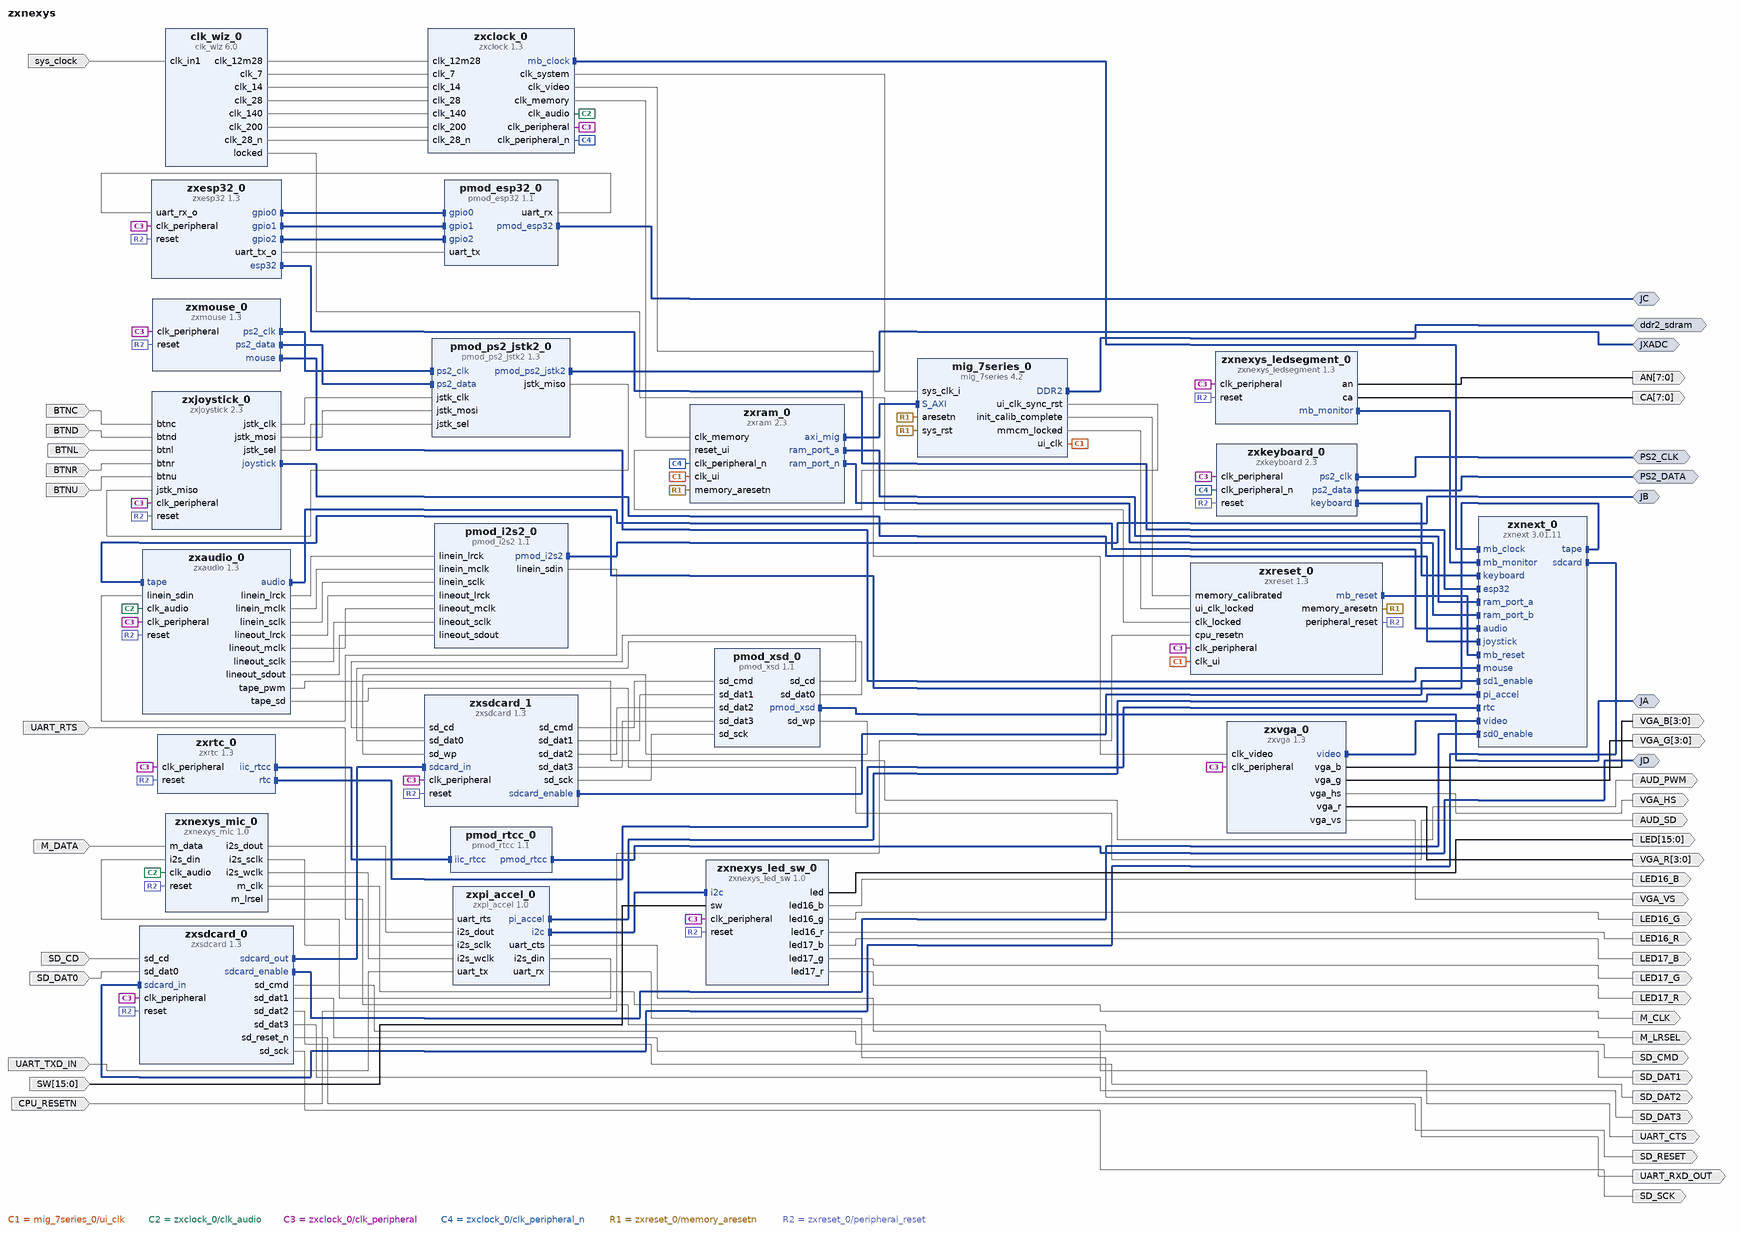
[diagram p0: block diagram of the top level]
# Vivado block design zxnexys, xc7a100tcsg324-1, Vivado 2021.2
create_bd_design zxnexys

create_bd_intf_port -mode Master -vlnv digilentinc.com:interface:pmod_rtl:1.0 JB
create_bd_intf_port -mode Master -vlnv digilentinc.com:interface:pmod_rtl:1.0 JC
create_bd_intf_port -mode Master -vlnv digilentinc.com:interface:pmod_rtl:1.0 JXADC
create_bd_intf_port -mode Master -vlnv xilinx.com:interface:gpio_rtl:1.0 PS2_CLK
create_bd_intf_port -mode Master -vlnv xilinx.com:interface:gpio_rtl:1.0 PS2_DATA
create_bd_intf_port -mode Master -vlnv digilentinc.com:interface:pmod_rtl:1.0 JD
create_bd_intf_port -mode Master -vlnv digilentinc.com:interface:pmod_rtl:1.0 JA
create_bd_intf_port -mode Master -vlnv xilinx.com:interface:ddrx_rtl:1.0 ddr2_sdram
create_bd_port -dir I -type clk sys_clock
set_property -dict {CONFIG.FREQ_HZ 100000000 CONFIG.PHASE 0.0} [get_bd_ports sys_clock]
create_bd_port -dir I -type rst CPU_RESETN
create_bd_port -dir O AUD_PWM
create_bd_port -dir O AUD_SD
create_bd_port -dir I BTNC
create_bd_port -dir I BTND
create_bd_port -dir I BTNL
create_bd_port -dir I BTNR
create_bd_port -dir I BTNU
create_bd_port -dir O -from 7 -to 0 AN
create_bd_port -dir O -from 7 -to 0 CA
create_bd_port -dir I UART_TXD_IN
create_bd_port -dir O UART_RXD_OUT
create_bd_port -dir O UART_CTS
create_bd_port -dir I UART_RTS
create_bd_port -dir I M_DATA
create_bd_port -dir O -type clk M_CLK
create_bd_port -dir O M_LRSEL
create_bd_port -dir I -from 15 -to 0 SW
create_bd_port -dir O -from 15 -to 0 LED
create_bd_port -dir O LED16_G
create_bd_port -dir O LED16_B
create_bd_port -dir O LED16_R
create_bd_port -dir O LED17_B
create_bd_port -dir O LED17_G
create_bd_port -dir O LED17_R
create_bd_port -dir I SD_CD
create_bd_port -dir I SD_DAT0
create_bd_port -dir O SD_RESET
create_bd_port -dir O SD_SCK
create_bd_port -dir O SD_CMD
create_bd_port -dir O SD_DAT1
create_bd_port -dir O SD_DAT2
create_bd_port -dir O SD_DAT3
create_bd_port -dir O -from 3 -to 0 VGA_B
create_bd_port -dir O -from 3 -to 0 VGA_G
create_bd_port -dir O VGA_HS
create_bd_port -dir O -from 3 -to 0 VGA_R
create_bd_port -dir O VGA_VS

create_bd_cell -type ip -vlnv xilinx.com:ip:clk_wiz:6.0 clk_wiz_0
set_property -dict [list \
  CONFIG.CLKOUT1_JITTER 130.488 \
  CONFIG.CLKOUT1_PHASE_ERROR 122.577 \
  CONFIG.CLKOUT1_REQUESTED_OUT_FREQ 200.000 \
  CONFIG.CLKOUT2_DRIVES No_buffer \
  CONFIG.CLKOUT2_JITTER 139.537 \
  CONFIG.CLKOUT2_PHASE_ERROR 122.577 \
  CONFIG.CLKOUT2_REQUESTED_OUT_FREQ 140.000 \
  CONFIG.CLKOUT2_USED true \
  CONFIG.CLKOUT3_DRIVES No_buffer \
  CONFIG.CLKOUT3_JITTER 193.383 \
  CONFIG.CLKOUT3_PHASE_ERROR 122.577 \
  CONFIG.CLKOUT3_REQUESTED_DUTY_CYCLE 50.000 \
  CONFIG.CLKOUT3_REQUESTED_OUT_FREQ 28.000 \
  CONFIG.CLKOUT3_REQUESTED_PHASE 180.000 \
  CONFIG.CLKOUT3_USED true \
  CONFIG.CLKOUT4_DRIVES No_buffer \
  CONFIG.CLKOUT4_JITTER 193.383 \
  CONFIG.CLKOUT4_PHASE_ERROR 122.577 \
  CONFIG.CLKOUT4_REQUESTED_OUT_FREQ 28.000 \
  CONFIG.CLKOUT4_USED true \
  CONFIG.CLKOUT5_DRIVES No_buffer \
  CONFIG.CLKOUT5_JITTER 221.798 \
  CONFIG.CLKOUT5_PHASE_ERROR 122.577 \
  CONFIG.CLKOUT5_REQUESTED_OUT_FREQ 14 \
  CONFIG.CLKOUT5_USED true \
  CONFIG.CLKOUT6_DRIVES No_buffer \
  CONFIG.CLKOUT6_JITTER 227.577 \
  CONFIG.CLKOUT6_PHASE_ERROR 122.577 \
  CONFIG.CLKOUT6_REQUESTED_OUT_FREQ 12.28070 \
  CONFIG.CLKOUT6_USED true \
  CONFIG.CLKOUT7_DRIVES No_buffer \
  CONFIG.CLKOUT7_JITTER 253.969 \
  CONFIG.CLKOUT7_PHASE_ERROR 122.577 \
  CONFIG.CLKOUT7_REQUESTED_OUT_FREQ 7.000 \
  CONFIG.CLKOUT7_USED true \
  CONFIG.CLK_IN1_BOARD_INTERFACE sys_clock \
  CONFIG.CLK_OUT1_PORT clk_200 \
  CONFIG.CLK_OUT2_PORT clk_140 \
  CONFIG.CLK_OUT3_PORT clk_28_n \
  CONFIG.CLK_OUT4_PORT clk_28 \
  CONFIG.CLK_OUT5_PORT clk_14 \
  CONFIG.CLK_OUT6_PORT clk_12m28 \
  CONFIG.CLK_OUT7_PORT clk_7 \
  CONFIG.MMCM_CLKFBOUT_MULT_F 7.000 \
  CONFIG.MMCM_CLKOUT0_DIVIDE_F 3.500 \
  CONFIG.MMCM_CLKOUT1_DIVIDE 5 \
  CONFIG.MMCM_CLKOUT2_DIVIDE 25 \
  CONFIG.MMCM_CLKOUT2_PHASE 180.000 \
  CONFIG.MMCM_CLKOUT3_DIVIDE 25 \
  CONFIG.MMCM_CLKOUT4_DIVIDE 50 \
  CONFIG.MMCM_CLKOUT5_DIVIDE 57 \
  CONFIG.MMCM_CLKOUT6_DIVIDE 100 \
  CONFIG.NUM_OUT_CLKS 7 \
  CONFIG.USE_BOARD_FLOW true \
  CONFIG.USE_RESET false \
] [get_bd_cells clk_wiz_0]
create_bd_cell -type ip -vlnv specnext.com:specnext:zxreset:1.3 zxreset_0
create_bd_cell -type ip -vlnv specnext.com:specnext:zxnext:3.01.11 zxnext_0
create_bd_cell -type ip -vlnv specnext.com:specnext:zxesp32:1.3 zxesp32_0
create_bd_cell -type ip -vlnv specnext.com:specnext:pmod_esp32:1.1 pmod_esp32_0
create_bd_cell -type ip -vlnv specnext.com:specnext:pmod_ps2_jstk2:1.3 pmod_ps2_jstk2_0
create_bd_cell -type ip -vlnv specnext.com:specnext:zxnexys_ledsegment:1.3 zxnexys_ledsegment_0
create_bd_cell -type ip -vlnv specnext.com:specnext:zxpi_accel:1.0 zxpi_accel_0
create_bd_cell -type ip -vlnv specnext.com:specnext:pmod_rtcc:1.1 pmod_rtcc_0
create_bd_cell -type ip -vlnv specnext.com:specnext:zxsdcard:1.3 zxsdcard_0
set_property -dict {CONFIG.Terminated false} [get_bd_cells zxsdcard_0]
create_bd_cell -type ip -vlnv specnext.com:specnext:zxsdcard:1.3 zxsdcard_1
set_property -dict {CONFIG.MicroSD false} [get_bd_cells zxsdcard_1]
create_bd_cell -type ip -vlnv specnext.com:specnext:pmod_xsd:1.1 pmod_xsd_0
set_property -dict {CONFIG.MicroSD false} [get_bd_cells pmod_xsd_0]
create_bd_cell -type ip -vlnv xilinx.com:ip:mig_7series:4.2 mig_7series_0
set_property -dict [list \
  CONFIG.BOARD_MIG_PARAM ddr2_sdram \
  CONFIG.RESET_BOARD_INTERFACE Custom \
  CONFIG.XML_INPUT_FILE mig_a.prj \
] [get_bd_cells mig_7series_0]
create_bd_cell -type ip -vlnv specnext.com:specnext:zxkeyboard:2.3 zxkeyboard_0
create_bd_cell -type ip -vlnv specnext.com:specnext:zxmouse:1.3 zxmouse_0
create_bd_cell -type ip -vlnv specnext.com:specnext:zxnexys_led_sw:1.0 zxnexys_led_sw_0
create_bd_cell -type ip -vlnv specnext.com:specnext:zxram:2.3 zxram_0
create_bd_cell -type ip -vlnv specnext.com:specnext:zxrtc:1.3 zxrtc_0
create_bd_cell -type ip -vlnv specnext.com:specnext:zxvga:1.3 zxvga_0
create_bd_cell -type ip -vlnv specnext.com:specnext:zxnexys_mic:1.0 zxnexys_mic_0
create_bd_cell -type ip -vlnv specnext.com:specnext:zxclock:1.3 zxclock_0
create_bd_cell -type ip -vlnv specnext.com:specnext:pmod_i2s2:1.1 pmod_i2s2_0
create_bd_cell -type ip -vlnv specnext.com:specnext:zxaudio:1.3 zxaudio_0
create_bd_cell -type ip -vlnv specnext.com:specnext:zxjoystick:2.3 zxjoystick_0

# ---- connections ----

connect_bd_intf_net [get_bd_intf_ports ddr2_sdram] [get_bd_intf_pins mig_7series_0/DDR2]
connect_bd_intf_net [get_bd_intf_ports JC] [get_bd_intf_pins pmod_esp32_0/pmod_esp32]
connect_bd_intf_net [get_bd_intf_ports JB] [get_bd_intf_pins pmod_i2s2_0/pmod_i2s2]
connect_bd_intf_net [get_bd_intf_ports JXADC] [get_bd_intf_pins pmod_ps2_jstk2_0/pmod_ps2_jstk2]
connect_bd_intf_net [get_bd_intf_ports JD] [get_bd_intf_pins pmod_rtcc_0/pmod_rtcc]
connect_bd_intf_net [get_bd_intf_ports JA] [get_bd_intf_pins pmod_xsd_0/pmod_xsd]
connect_bd_intf_net [get_bd_intf_pins zxclock_0/mb_clock] [get_bd_intf_pins zxnext_0/mb_clock]
connect_bd_intf_net [get_bd_intf_pins zxesp32_0/gpio0] [get_bd_intf_pins pmod_esp32_0/gpio0]
connect_bd_intf_net [get_bd_intf_pins zxesp32_0/gpio1] [get_bd_intf_pins pmod_esp32_0/gpio1]
connect_bd_intf_net [get_bd_intf_pins zxesp32_0/gpio2] [get_bd_intf_pins pmod_esp32_0/gpio2]
connect_bd_intf_net [get_bd_intf_ports PS2_CLK] [get_bd_intf_pins zxkeyboard_0/ps2_clk]
connect_bd_intf_net [get_bd_intf_ports PS2_DATA] [get_bd_intf_pins zxkeyboard_0/ps2_data]
connect_bd_intf_net [get_bd_intf_pins zxmouse_0/ps2_clk] [get_bd_intf_pins pmod_ps2_jstk2_0/ps2_clk]
connect_bd_intf_net [get_bd_intf_pins zxmouse_0/ps2_data] [get_bd_intf_pins pmod_ps2_jstk2_0/ps2_data]
connect_bd_intf_net [get_bd_intf_pins zxaudio_0/audio] [get_bd_intf_pins zxnext_0/audio]
connect_bd_intf_net [get_bd_intf_pins zxesp32_0/esp32] [get_bd_intf_pins zxnext_0/esp32]
connect_bd_intf_net [get_bd_intf_pins zxjoystick_0/joystick] [get_bd_intf_pins zxnext_0/joystick]
connect_bd_intf_net [get_bd_intf_pins zxkeyboard_0/keyboard] [get_bd_intf_pins zxnext_0/keyboard]
connect_bd_intf_net [get_bd_intf_pins zxnexys_ledsegment_0/mb_monitor] [get_bd_intf_pins zxnext_0/mb_monitor]
connect_bd_intf_net [get_bd_intf_pins zxmouse_0/mouse] [get_bd_intf_pins zxnext_0/mouse]
connect_bd_intf_net [get_bd_intf_pins zxpi_accel_0/pi_accel] [get_bd_intf_pins zxnext_0/pi_accel]
connect_bd_intf_net [get_bd_intf_pins zxram_0/ram_port_a] [get_bd_intf_pins zxnext_0/ram_port_a]
connect_bd_intf_net [get_bd_intf_pins zxram_0/ram_port_n] [get_bd_intf_pins zxnext_0/ram_port_b]
connect_bd_intf_net [get_bd_intf_pins zxrtc_0/rtc] [get_bd_intf_pins zxnext_0/rtc]
connect_bd_intf_net [get_bd_intf_pins zxsdcard_0/sdcard_enable] [get_bd_intf_pins zxnext_0/sd0_enable]
connect_bd_intf_net [get_bd_intf_pins zxsdcard_1/sdcard_enable] [get_bd_intf_pins zxnext_0/sd1_enable]
connect_bd_intf_net [get_bd_intf_pins zxsdcard_0/sdcard_in] [get_bd_intf_pins zxnext_0/sdcard]
connect_bd_intf_net [get_bd_intf_pins zxnext_0/tape] [get_bd_intf_pins zxaudio_0/tape]
connect_bd_intf_net [get_bd_intf_pins zxvga_0/video] [get_bd_intf_pins zxnext_0/video]
connect_bd_intf_net [get_bd_intf_pins zxpi_accel_0/i2c] [get_bd_intf_pins zxnexys_led_sw_0/i2c]
connect_bd_intf_net [get_bd_intf_pins zxram_0/axi_mig] [get_bd_intf_pins mig_7series_0/S_AXI]
connect_bd_intf_net [get_bd_intf_pins zxreset_0/mb_reset] [get_bd_intf_pins zxnext_0/mb_reset]
connect_bd_intf_net [get_bd_intf_pins zxrtc_0/iic_rtcc] [get_bd_intf_pins pmod_rtcc_0/iic_rtcc]
connect_bd_intf_net [get_bd_intf_pins zxsdcard_0/sdcard_out] [get_bd_intf_pins zxsdcard_1/sdcard_in]
connect_bd_net [get_bd_ports BTNC] [get_bd_pins zxjoystick_0/btnc]
connect_bd_net [get_bd_ports BTND] [get_bd_pins zxjoystick_0/btnd]
connect_bd_net [get_bd_ports BTNL] [get_bd_pins zxjoystick_0/btnl]
connect_bd_net [get_bd_ports BTNR] [get_bd_pins zxjoystick_0/btnr]
connect_bd_net [get_bd_ports BTNU] [get_bd_pins zxjoystick_0/btnu]
connect_bd_net [get_bd_ports CPU_RESETN] [get_bd_pins zxreset_0/cpu_resetn]
connect_bd_net [get_bd_ports M_DATA] [get_bd_pins zxnexys_mic_0/m_data]
connect_bd_net [get_bd_ports SD_CD] [get_bd_pins zxsdcard_0/sd_cd]
connect_bd_net -net SD_DAT0_1 [get_bd_ports SD_DAT0] [get_bd_pins zxsdcard_0/sd_dat0]
connect_bd_net [get_bd_ports SW] [get_bd_pins zxnexys_led_sw_0/sw]
connect_bd_net [get_bd_ports UART_RTS] [get_bd_pins zxpi_accel_0/uart_rts]
connect_bd_net [get_bd_ports UART_TXD_IN] [get_bd_pins zxpi_accel_0/uart_tx]
connect_bd_net [get_bd_pins clk_wiz_0/clk_12m28] [get_bd_pins zxclock_0/clk_12m28]
connect_bd_net [get_bd_pins clk_wiz_0/clk_7] [get_bd_pins zxclock_0/clk_7]
connect_bd_net [get_bd_pins clk_wiz_0/clk_14] [get_bd_pins zxclock_0/clk_14]
connect_bd_net [get_bd_pins clk_wiz_0/clk_28] [get_bd_pins zxclock_0/clk_28]
connect_bd_net [get_bd_pins clk_wiz_0/clk_140] [get_bd_pins zxclock_0/clk_140]
connect_bd_net [get_bd_pins clk_wiz_0/clk_200] [get_bd_pins zxclock_0/clk_200]
connect_bd_net [get_bd_pins clk_wiz_0/clk_28_n] [get_bd_pins zxclock_0/clk_28_n]
connect_bd_net [get_bd_pins clk_wiz_0/locked] [get_bd_pins zxreset_0/clk_locked]
connect_bd_net [get_bd_pins mig_7series_0/init_calib_complete] [get_bd_pins zxreset_0/memory_calibrated]
connect_bd_net [get_bd_pins mig_7series_0/mmcm_locked] [get_bd_pins zxreset_0/ui_clk_locked]
connect_bd_net [get_bd_pins mig_7series_0/ui_clk] [get_bd_pins zxreset_0/clk_ui] [get_bd_pins zxram_0/clk_ui]
connect_bd_net [get_bd_pins mig_7series_0/ui_clk_sync_rst] [get_bd_pins zxram_0/reset_ui]
connect_bd_net [get_bd_pins pmod_esp32_0/uart_rx] [get_bd_pins zxesp32_0/uart_rx_o]
connect_bd_net [get_bd_pins pmod_i2s2_0/linein_sdin] [get_bd_pins zxaudio_0/linein_sdin]
connect_bd_net [get_bd_pins pmod_ps2_jstk2_0/jstk_miso] [get_bd_pins zxjoystick_0/jstk_miso]
connect_bd_net [get_bd_pins pmod_xsd_0/sd_cd] [get_bd_pins zxsdcard_1/sd_cd]
connect_bd_net [get_bd_pins pmod_xsd_0/sd_dat0] [get_bd_pins zxsdcard_1/sd_dat0]
connect_bd_net [get_bd_pins pmod_xsd_0/sd_wp] [get_bd_pins zxsdcard_1/sd_wp]
connect_bd_net [get_bd_ports sys_clock] [get_bd_pins clk_wiz_0/clk_in1]
connect_bd_net [get_bd_pins zxaudio_0/linein_lrck] [get_bd_pins pmod_i2s2_0/linein_lrck]
connect_bd_net [get_bd_pins zxaudio_0/linein_mclk] [get_bd_pins pmod_i2s2_0/linein_mclk]
connect_bd_net [get_bd_pins zxaudio_0/linein_sclk] [get_bd_pins pmod_i2s2_0/linein_sclk]
connect_bd_net [get_bd_pins zxaudio_0/lineout_lrck] [get_bd_pins pmod_i2s2_0/lineout_lrck]
connect_bd_net [get_bd_pins zxaudio_0/lineout_mclk] [get_bd_pins pmod_i2s2_0/lineout_mclk]
connect_bd_net [get_bd_pins zxaudio_0/lineout_sclk] [get_bd_pins pmod_i2s2_0/lineout_sclk]
connect_bd_net [get_bd_pins zxaudio_0/lineout_sdout] [get_bd_pins pmod_i2s2_0/lineout_sdout]
connect_bd_net [get_bd_pins zxaudio_0/tape_pwm] [get_bd_ports AUD_PWM]
connect_bd_net [get_bd_pins zxaudio_0/tape_sd] [get_bd_ports AUD_SD]
connect_bd_net [get_bd_pins zxclock_0/clk_audio] [get_bd_pins zxnexys_mic_0/clk_audio] [get_bd_pins zxaudio_0/clk_audio]
connect_bd_net [get_bd_pins zxclock_0/clk_memory] [get_bd_pins zxram_0/clk_memory]
connect_bd_net [get_bd_pins zxclock_0/clk_peripheral] \
  [get_bd_pins zxreset_0/clk_peripheral] [get_bd_pins zxesp32_0/clk_peripheral] \
  [get_bd_pins zxnexys_ledsegment_0/clk_peripheral] [get_bd_pins zxsdcard_1/clk_peripheral] \
  [get_bd_pins zxsdcard_0/clk_peripheral] [get_bd_pins zxkeyboard_0/clk_peripheral] [get_bd_pins zxmouse_0/clk_peripheral] \
  [get_bd_pins zxnexys_led_sw_0/clk_peripheral] [get_bd_pins zxrtc_0/clk_peripheral] [get_bd_pins zxvga_0/clk_peripheral] \
  [get_bd_pins zxaudio_0/clk_peripheral] [get_bd_pins zxjoystick_0/clk_peripheral]
connect_bd_net [get_bd_pins zxclock_0/clk_peripheral_n] [get_bd_pins zxkeyboard_0/clk_peripheral_n] [get_bd_pins zxram_0/clk_peripheral_n]
connect_bd_net [get_bd_pins zxclock_0/clk_system] [get_bd_pins mig_7series_0/sys_clk_i]
connect_bd_net [get_bd_pins zxclock_0/clk_video] [get_bd_pins zxvga_0/clk_video]
connect_bd_net [get_bd_pins zxesp32_0/uart_tx_o] [get_bd_pins pmod_esp32_0/uart_tx]
connect_bd_net [get_bd_pins zxjoystick_0/jstk_clk] [get_bd_pins pmod_ps2_jstk2_0/jstk_clk]
connect_bd_net [get_bd_pins zxjoystick_0/jstk_mosi] [get_bd_pins pmod_ps2_jstk2_0/jstk_mosi]
connect_bd_net [get_bd_pins zxjoystick_0/jstk_sel] [get_bd_pins pmod_ps2_jstk2_0/jstk_sel]
connect_bd_net [get_bd_pins zxnexys_led_sw_0/led] [get_bd_ports LED]
connect_bd_net [get_bd_pins zxnexys_led_sw_0/led16_b] [get_bd_ports LED16_B]
connect_bd_net [get_bd_pins zxnexys_led_sw_0/led16_g] [get_bd_ports LED16_G]
connect_bd_net [get_bd_pins zxnexys_led_sw_0/led16_r] [get_bd_ports LED16_R]
connect_bd_net [get_bd_pins zxnexys_led_sw_0/led17_b] [get_bd_ports LED17_B]
connect_bd_net [get_bd_pins zxnexys_led_sw_0/led17_g] [get_bd_ports LED17_G]
connect_bd_net [get_bd_pins zxnexys_led_sw_0/led17_r] [get_bd_ports LED17_R]
connect_bd_net [get_bd_pins zxnexys_ledsegment_0/an] [get_bd_ports AN]
connect_bd_net [get_bd_pins zxnexys_ledsegment_0/ca] [get_bd_ports CA]
connect_bd_net [get_bd_pins zxnexys_mic_0/i2s_dout] [get_bd_pins zxpi_accel_0/i2s_dout]
connect_bd_net [get_bd_pins zxnexys_mic_0/i2s_sclk] [get_bd_pins zxpi_accel_0/i2s_sclk]
connect_bd_net [get_bd_pins zxnexys_mic_0/i2s_wclk] [get_bd_pins zxpi_accel_0/i2s_wclk]
connect_bd_net [get_bd_pins zxnexys_mic_0/m_clk] [get_bd_ports M_CLK]
connect_bd_net [get_bd_pins zxnexys_mic_0/m_lrsel] [get_bd_ports M_LRSEL]
connect_bd_net [get_bd_pins zxpi_accel_0/i2s_din] [get_bd_pins zxnexys_mic_0/i2s_din]
connect_bd_net [get_bd_pins zxpi_accel_0/uart_cts] [get_bd_ports UART_CTS]
connect_bd_net [get_bd_pins zxpi_accel_0/uart_rx] [get_bd_ports UART_RXD_OUT]
connect_bd_net [get_bd_pins zxreset_0/memory_aresetn] \
  [get_bd_pins mig_7series_0/sys_rst] [get_bd_pins mig_7series_0/aresetn] [get_bd_pins zxram_0/memory_aresetn]
connect_bd_net [get_bd_pins zxreset_0/peripheral_reset] \
  [get_bd_pins zxesp32_0/reset] [get_bd_pins zxnexys_ledsegment_0/reset] [get_bd_pins zxsdcard_1/reset] \
  [get_bd_pins zxsdcard_0/reset] [get_bd_pins zxkeyboard_0/reset] [get_bd_pins zxmouse_0/reset] \
  [get_bd_pins zxnexys_led_sw_0/reset] [get_bd_pins zxrtc_0/reset] [get_bd_pins zxnexys_mic_0/reset] \
  [get_bd_pins zxaudio_0/reset] [get_bd_pins zxjoystick_0/reset]
connect_bd_net [get_bd_pins zxsdcard_0/sd_cmd] [get_bd_ports SD_CMD]
connect_bd_net [get_bd_pins zxsdcard_0/sd_dat1] [get_bd_ports SD_DAT1]
connect_bd_net [get_bd_pins zxsdcard_0/sd_dat2] [get_bd_ports SD_DAT2]
connect_bd_net [get_bd_pins zxsdcard_0/sd_dat3] [get_bd_ports SD_DAT3]
connect_bd_net [get_bd_pins zxsdcard_0/sd_reset_n] [get_bd_ports SD_RESET]
connect_bd_net [get_bd_pins zxsdcard_0/sd_sck] [get_bd_ports SD_SCK]
connect_bd_net [get_bd_pins zxsdcard_1/sd_cmd] [get_bd_pins pmod_xsd_0/sd_cmd]
connect_bd_net [get_bd_pins zxsdcard_1/sd_dat1] [get_bd_pins pmod_xsd_0/sd_dat1]
connect_bd_net [get_bd_pins zxsdcard_1/sd_dat2] [get_bd_pins pmod_xsd_0/sd_dat2]
connect_bd_net [get_bd_pins zxsdcard_1/sd_dat3] [get_bd_pins pmod_xsd_0/sd_dat3]
connect_bd_net [get_bd_pins zxsdcard_1/sd_sck] [get_bd_pins pmod_xsd_0/sd_sck]
connect_bd_net [get_bd_pins zxvga_0/vga_b] [get_bd_ports VGA_B]
connect_bd_net [get_bd_pins zxvga_0/vga_g] [get_bd_ports VGA_G]
connect_bd_net [get_bd_pins zxvga_0/vga_hs] [get_bd_ports VGA_HS]
connect_bd_net [get_bd_pins zxvga_0/vga_r] [get_bd_ports VGA_R]
connect_bd_net [get_bd_pins zxvga_0/vga_vs] [get_bd_ports VGA_VS]

# ---- address map ----
assign_bd_address -offset 0x0000000 -range 128M -target_address_space [get_bd_addr_spaces zxram_0/axi_mig] [get_bd_addr_segs mig_7series_0/memmap/memaddr]

validate_bd_design
save_bd_design
